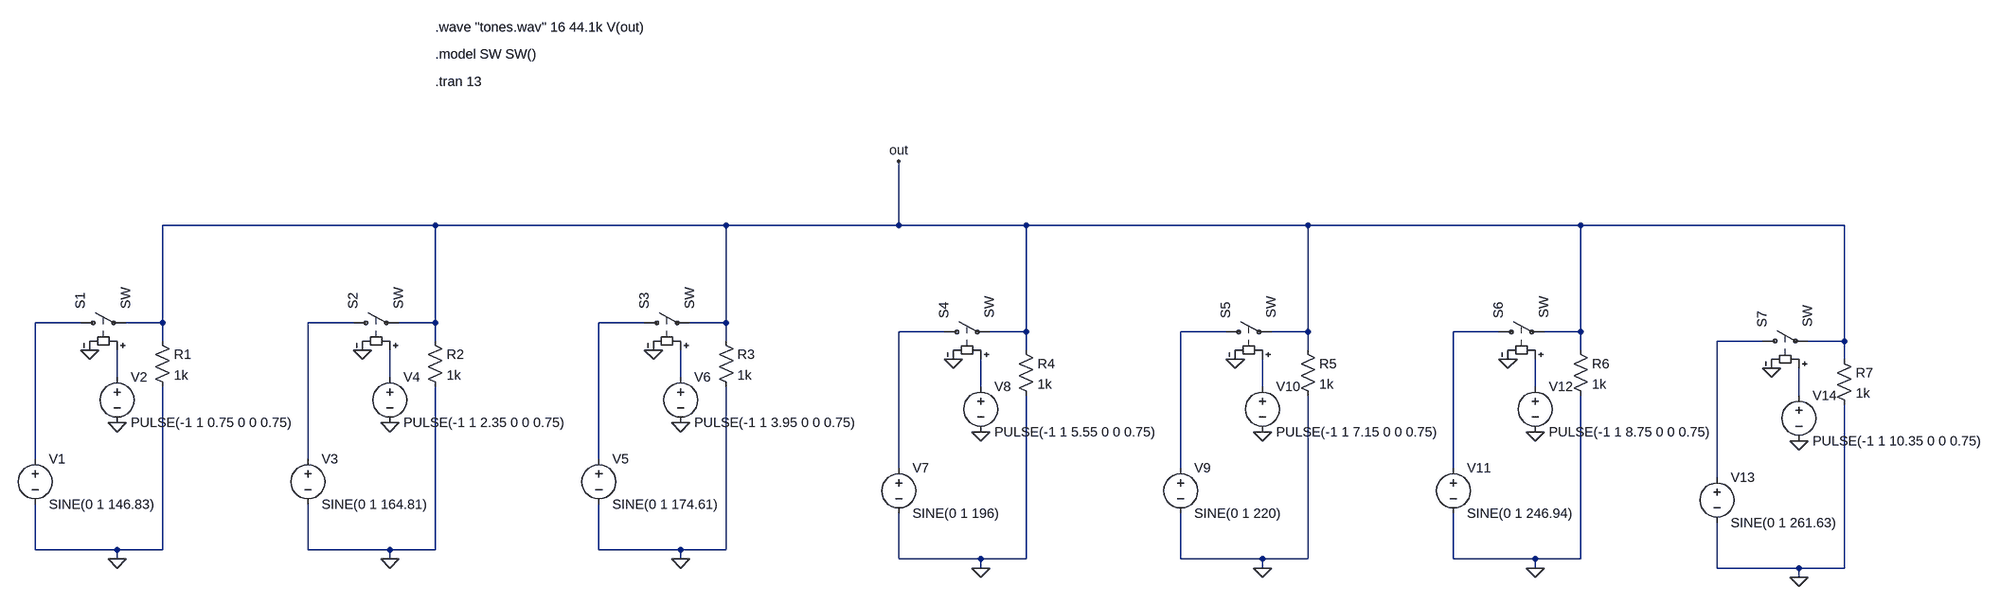
[diagram p0: schematic IMT2019508tone_generator.asc]
IMT2019508tone_generator.asc, the LTspice schematic file:
Version 4
SHEET 1 3192 680
WIRE 448 -448 -32 -448
WIRE 960 -448 448 -448
WIRE 1264 -448 1264 -704
WIRE 1264 -448 960 -448
WIRE 1488 -448 1264 -448
WIRE 1984 -448 1488 -448
WIRE 2464 -448 1984 -448
WIRE 2928 -448 2464 -448
WIRE -176 -256 -256 -256
WIRE -32 -256 -32 -448
WIRE -32 -256 -96 -256
WIRE 304 -256 224 -256
WIRE 448 -256 448 -448
WIRE 448 -256 384 -256
WIRE 816 -256 736 -256
WIRE 960 -256 960 -448
WIRE 960 -256 896 -256
WIRE 1344 -240 1264 -240
WIRE 1488 -240 1488 -448
WIRE 1488 -240 1424 -240
WIRE 1840 -240 1760 -240
WIRE 1984 -240 1984 -448
WIRE 1984 -240 1920 -240
WIRE 2320 -240 2240 -240
WIRE 2464 -240 2464 -448
WIRE 2464 -240 2400 -240
WIRE -32 -224 -32 -256
WIRE 448 -224 448 -256
WIRE 960 -224 960 -256
WIRE 2784 -224 2704 -224
WIRE 2928 -224 2928 -448
WIRE 2928 -224 2864 -224
WIRE 1488 -208 1488 -240
WIRE 1984 -208 1984 -240
WIRE 2464 -208 2464 -240
WIRE 2928 -192 2928 -224
WIRE -112 -160 -112 -208
WIRE 368 -160 368 -208
WIRE 880 -160 880 -208
WIRE 1408 -144 1408 -192
WIRE 1904 -144 1904 -192
WIRE 2384 -144 2384 -192
WIRE 2848 -128 2848 -176
WIRE -256 -16 -256 -256
WIRE 224 -16 224 -256
WIRE 736 -16 736 -256
WIRE 1264 0 1264 -240
WIRE 1760 0 1760 -240
WIRE 2240 0 2240 -240
WIRE 2704 16 2704 -224
WIRE -256 144 -256 64
WIRE -112 144 -256 144
WIRE -32 144 -32 -144
WIRE -32 144 -112 144
WIRE 224 144 224 64
WIRE 368 144 224 144
WIRE 448 144 448 -144
WIRE 448 144 368 144
WIRE 736 144 736 64
WIRE 880 144 736 144
WIRE 960 144 960 -144
WIRE 960 144 880 144
WIRE -112 160 -112 144
WIRE 368 160 368 144
WIRE 880 160 880 144
WIRE 1264 160 1264 80
WIRE 1408 160 1264 160
WIRE 1488 160 1488 -128
WIRE 1488 160 1408 160
WIRE 1760 160 1760 80
WIRE 1904 160 1760 160
WIRE 1984 160 1984 -128
WIRE 1984 160 1904 160
WIRE 2240 160 2240 80
WIRE 2384 160 2240 160
WIRE 2464 160 2464 -128
WIRE 2464 160 2384 160
WIRE 1408 176 1408 160
WIRE 1904 176 1904 160
WIRE 2384 176 2384 160
WIRE 2704 176 2704 96
WIRE 2848 176 2704 176
WIRE 2928 176 2928 -112
WIRE 2928 176 2848 176
WIRE 2848 192 2848 176
FLAG -112 160 0
FLAG -160 -208 0
FLAG -112 -80 0
FLAG 368 160 0
FLAG 320 -208 0
FLAG 368 -80 0
FLAG 880 160 0
FLAG 832 -208 0
FLAG 880 -80 0
FLAG 1408 176 0
FLAG 1360 -192 0
FLAG 1408 -64 0
FLAG 1904 176 0
FLAG 1856 -192 0
FLAG 1904 -64 0
FLAG 2384 176 0
FLAG 2336 -192 0
FLAG 2384 -64 0
FLAG 2848 192 0
FLAG 2800 -176 0
FLAG 2848 -48 0
FLAG 1264 -704 out
SYMBOL voltage -256 -32 R0
WINDOW 123 0 0 Left 0
WINDOW 39 0 0 Left 0
SYMATTR InstName V1
SYMATTR Value SINE(0 1 146.83)
SYMBOL sw -192 -256 R270
SYMATTR InstName S1
SYMBOL voltage -112 -176 R0
WINDOW 123 0 0 Left 0
WINDOW 39 0 0 Left 0
SYMATTR InstName V2
SYMATTR Value PULSE(-1 1 0.75 0 0 0.75)
SYMBOL res -48 -240 R0
SYMATTR InstName R1
SYMATTR Value 1k
SYMBOL voltage 224 -32 R0
WINDOW 123 0 0 Left 0
WINDOW 39 0 0 Left 0
SYMATTR InstName V3
SYMATTR Value SINE(0 1 164.81)
SYMBOL sw 288 -256 R270
SYMATTR InstName S2
SYMBOL voltage 368 -176 R0
WINDOW 123 0 0 Left 0
WINDOW 39 0 0 Left 0
SYMATTR InstName V4
SYMATTR Value PULSE(-1 1 2.35 0 0 0.75)
SYMBOL res 432 -240 R0
SYMATTR InstName R2
SYMATTR Value 1k
SYMBOL voltage 736 -32 R0
WINDOW 123 0 0 Left 0
WINDOW 39 0 0 Left 0
SYMATTR InstName V5
SYMATTR Value SINE(0 1 174.61)
SYMBOL sw 800 -256 R270
SYMATTR InstName S3
SYMBOL voltage 880 -176 R0
WINDOW 123 0 0 Left 0
WINDOW 39 0 0 Left 0
SYMATTR InstName V6
SYMATTR Value PULSE(-1 1 3.95 0 0 0.75)
SYMBOL res 944 -240 R0
SYMATTR InstName R3
SYMATTR Value 1k
SYMBOL voltage 1264 -16 R0
WINDOW 123 0 0 Left 0
WINDOW 39 0 0 Left 0
SYMATTR InstName V7
SYMATTR Value SINE(0 1 196)
SYMBOL sw 1328 -240 R270
SYMATTR InstName S4
SYMBOL voltage 1408 -160 R0
WINDOW 123 0 0 Left 0
WINDOW 39 0 0 Left 0
SYMATTR InstName V8
SYMATTR Value PULSE(-1 1 5.55 0 0 0.75)
SYMBOL res 1472 -224 R0
SYMATTR InstName R4
SYMATTR Value 1k
SYMBOL voltage 1760 -16 R0
WINDOW 123 0 0 Left 0
WINDOW 39 0 0 Left 0
SYMATTR InstName V9
SYMATTR Value SINE(0 1 220)
SYMBOL sw 1824 -240 R270
SYMATTR InstName S5
SYMBOL voltage 1904 -160 R0
WINDOW 123 0 0 Left 0
WINDOW 39 0 0 Left 0
SYMATTR InstName V10
SYMATTR Value PULSE(-1 1 7.15 0 0 0.75)
SYMBOL res 1968 -224 R0
SYMATTR InstName R5
SYMATTR Value 1k
SYMBOL voltage 2240 -16 R0
WINDOW 123 0 0 Left 0
WINDOW 39 0 0 Left 0
SYMATTR InstName V11
SYMATTR Value SINE(0 1 246.94)
SYMBOL sw 2304 -240 R270
SYMATTR InstName S6
SYMBOL voltage 2384 -160 R0
WINDOW 123 0 0 Left 0
WINDOW 39 0 0 Left 0
SYMATTR InstName V12
SYMATTR Value PULSE(-1 1 8.75 0 0 0.75)
SYMBOL res 2448 -224 R0
SYMATTR InstName R6
SYMATTR Value 1k
SYMBOL voltage 2704 0 R0
WINDOW 123 0 0 Left 0
WINDOW 39 0 0 Left 0
SYMATTR InstName V13
SYMATTR Value SINE(0 1 261.63)
SYMBOL sw 2768 -224 R270
SYMATTR InstName S7
SYMBOL voltage 2848 -144 R0
WINDOW 123 0 0 Left 0
WINDOW 39 0 0 Left 0
SYMATTR InstName V14
SYMATTR Value PULSE(-1 1 10.35 0 0 0.75)
SYMBOL res 2912 -208 R0
SYMATTR InstName R7
SYMATTR Value 1k
TEXT 448 -936 Left 2 !.model SW SW()
TEXT 448 -888 Left 2 !.tran 13
TEXT 448 -984 Left 2 !.wave "tones.wav" 16 44.1k V(out)

The netlist it stands for:
* IMT2019508tone_generator.asc
V1 N001 0 SINE(0 1 146.83)
S1 N001 out N008 0 SW
V2 N008 0 PULSE(-1 1 0.75 0 0 0.75)
R1 out 0 1k
V3 N002 0 SINE(0 1 164.81)
S2 N002 out N009 0 SW
V4 N009 0 PULSE(-1 1 2.35 0 0 0.75)
R2 out 0 1k
V5 N003 0 SINE(0 1 174.61)
S3 N003 out N010 0 SW
V6 N010 0 PULSE(-1 1 3.95 0 0 0.75)
R3 out 0 1k
V7 N004 0 SINE(0 1 196)
S4 N004 out N011 0 SW
V8 N011 0 PULSE(-1 1 5.55 0 0 0.75)
R4 out 0 1k
V9 N005 0 SINE(0 1 220)
S5 N005 out N012 0 SW
V10 N012 0 PULSE(-1 1 7.15 0 0 0.75)
R5 out 0 1k
V11 N006 0 SINE(0 1 246.94)
S6 N006 out N013 0 SW
V12 N013 0 PULSE(-1 1 8.75 0 0 0.75)
R6 out 0 1k
V13 N007 0 SINE(0 1 261.63)
S7 N007 out N014 0 SW
V14 N014 0 PULSE(-1 1 10.35 0 0 0.75)
R7 out 0 1k
.model SW SW()
.tran 13
.wave "tones.wav" 16 44.1k V(out)
.backanno
.end